# Altium schematic sheet Block_Diagram.SchDoc
size A4; SheetNumber: 27
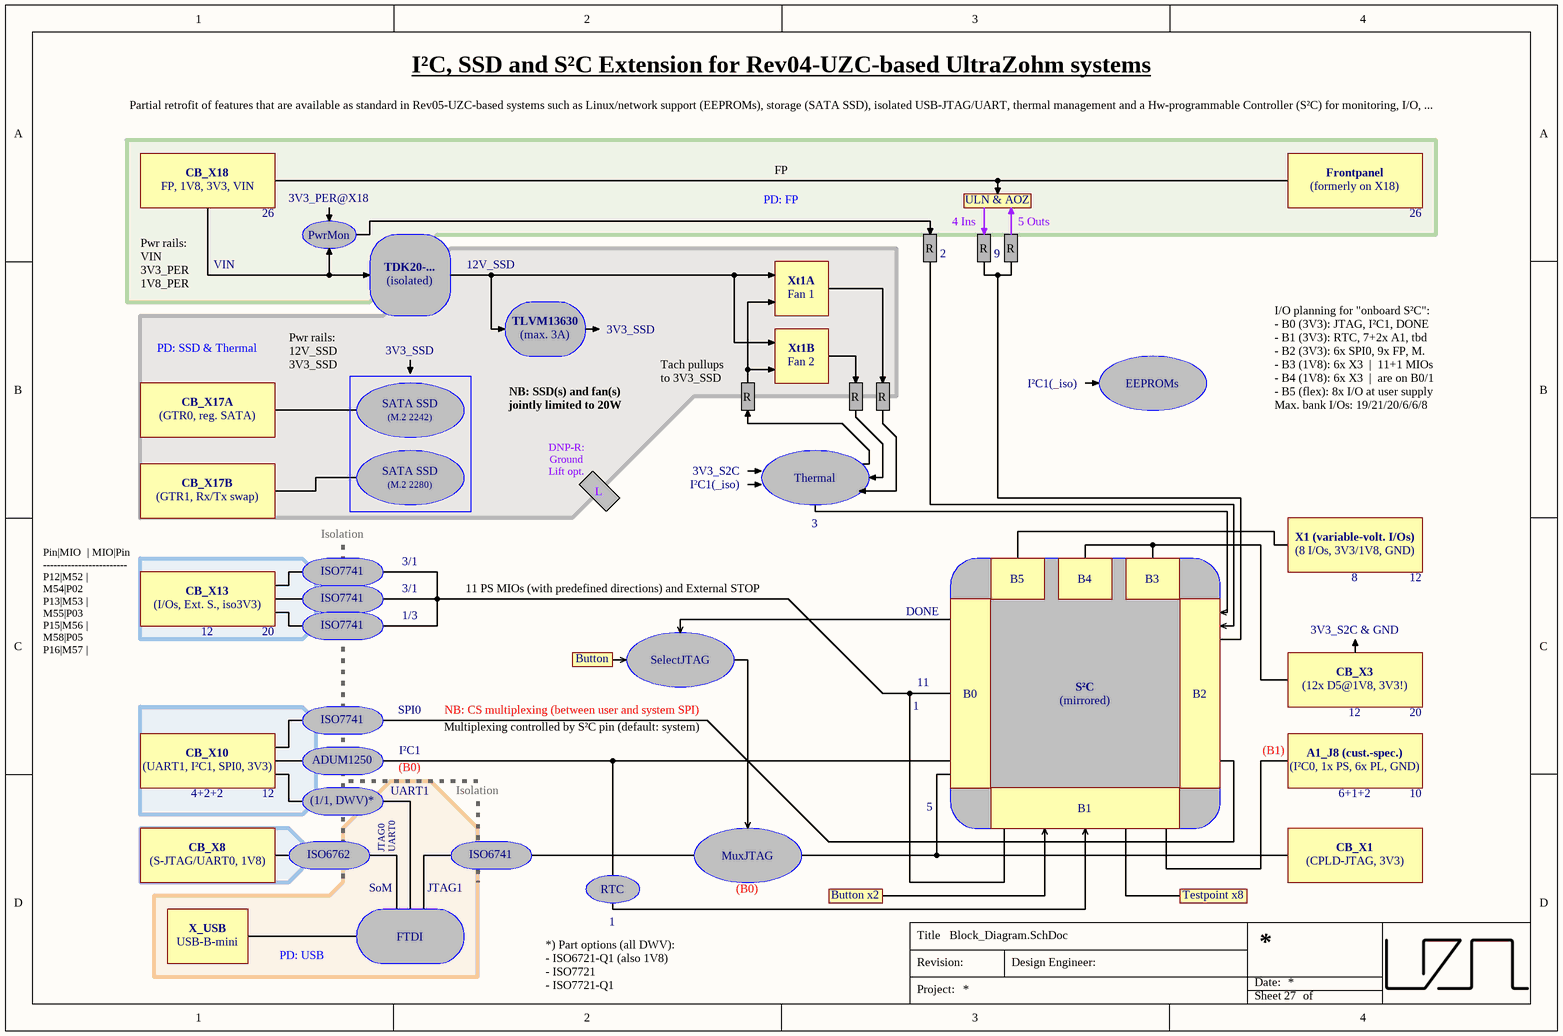
[diagram p0: Block_Diagram.SchDoc]

## Notes on the sheet
- I²C, SSD and S²C Extension for Rev04-UZC-based UltraZohm systems
- Partial retrofit of features that are available as standard in Rev05-UZC-based systems such as Linux/network support (EEPROMs), storage (SATA SSD), isolated USB-JTAG/UART, thermal management and a Hw-programmable Controller (S²C) for monitoring, I/O, ...
- CB_X18
- FP
- Frontpanel
- FP, 1V8, 3V3, VIN
- 26
- PwrMon
- 3V3_PER@X18
- PD: FP
- R
- 4 Ins
- ULN & AOZ
- 5 Outs
- (formerly on X18)
- Pwr rails:
  VIN
  3V3_PER
  1V8_PER
- VIN
- (isolated)
- TDK20-...
- 12V_SSD
- Xt1A
- Fan 1
- 2
- 9
- PD: SSD & Thermal
- Pwr rails:
  12V_SSD
  3V3_SSD
- 3V3_SSD
- TLVM13630
- (max. 3A)
- Tach pullups to 3V3_SSD
- Xt1B
- Fan 2
- I²C1(_iso)
- EEPROMs
- CB_X17A
- (GTR0, reg. SATA)
- SATA SSD
- (M.2 2242)
- NB: SSD(s) and fan(s) jointly limited to 20W
- I/O planning for "onboard S²C":
  - B0 (3V3): JTAG, I²C1, DONE
  - B1 (3V3): RTC, 7+2x A1, tbd
  - B2 (3V3): 6x SPI0, 9x FP, M.
  - B3 (1V8): 6x X3  |  11+1 MIOs
  - B4 (1V8): 6x X3  |  are on B0/1
  - B5 (flex): 8x I/O at user supply
  Max. bank I/Os: 19/21/20/6/6/8
- CB_X17B
- (GTR1, Rx/Tx swap)
- (M.2 2280)
- DNP-R: Ground Lift opt.
- L
- 3V3_S2C
- Thermal
- ISO7741
- Isolation
- 3/1
- 3
- B5
- B4
- B3
- X1 (variable-volt. I/Os)
- (8 I/Os, 3V3/1V8, GND)
- 8
- 12
- Pin|MIO  | MIO|Pin
  ------------------------
  P12|M52 | M54|P02
  P13|M53 | M55|P03
  P15|M56 | M58|P05
  P16|M57 | M59|P06
  P18|M60 | M62|P08
  P19|M61 | !ES!|P09
  6x In    |  5xO 1xI
- CB_X13
- (I/Os, Ext. S., iso3V3)
- 20
- 1/3
- 11 PS MIOs (with predefined directions) and External STOP
- SelectJTAG
- DONE
- 3V3_S2C & GND
- SPI0
- NB: CS multiplexing (between user and system SPI)
- Button
- 1
- 11
- B0
- S²C
- (mirrored)
- B2
- CB_X3
- (12x D5@1V8, 3V3!)
- CB_X10
- (UART1, I²C1, SPI0, 3V3)
- ADUM1250
- I²C1
- (B0)
- Multiplexing controlled by S²C pin (default: system)
- (B1)
- A1_J8 (cust.-spec.)
- (I²C0, 1x PS, 6x PL, GND)
- CB_X8
- 4+2+2
- (1/1, DWV)*
- JTAG0
- UART0
- UART1
- MuxJTAG
- 5
- B1
- CB_X1
- 6+1+2
- 10
- (S-JTAG/UART0, 1V8)
- ISO6762
- SoM
- JTAG1
- ISO6741
- RTC
- Button x2
- Testpoint x8
- (CPLD-JTAG, 3V3)
- X_USB
- USB-B-mini
- PD: USB
- FTDI
- *) Part options (all DWV):
  - ISO6721-Q1 (also 1V8)
  - ISO7721
  - ISO7721-Q1
- Title
- Revision:
- Design Engineer:
- Date:
- Project:
- Sheet
- of